# EAGLE design floppy_emul (EAGLE 8.2.2)
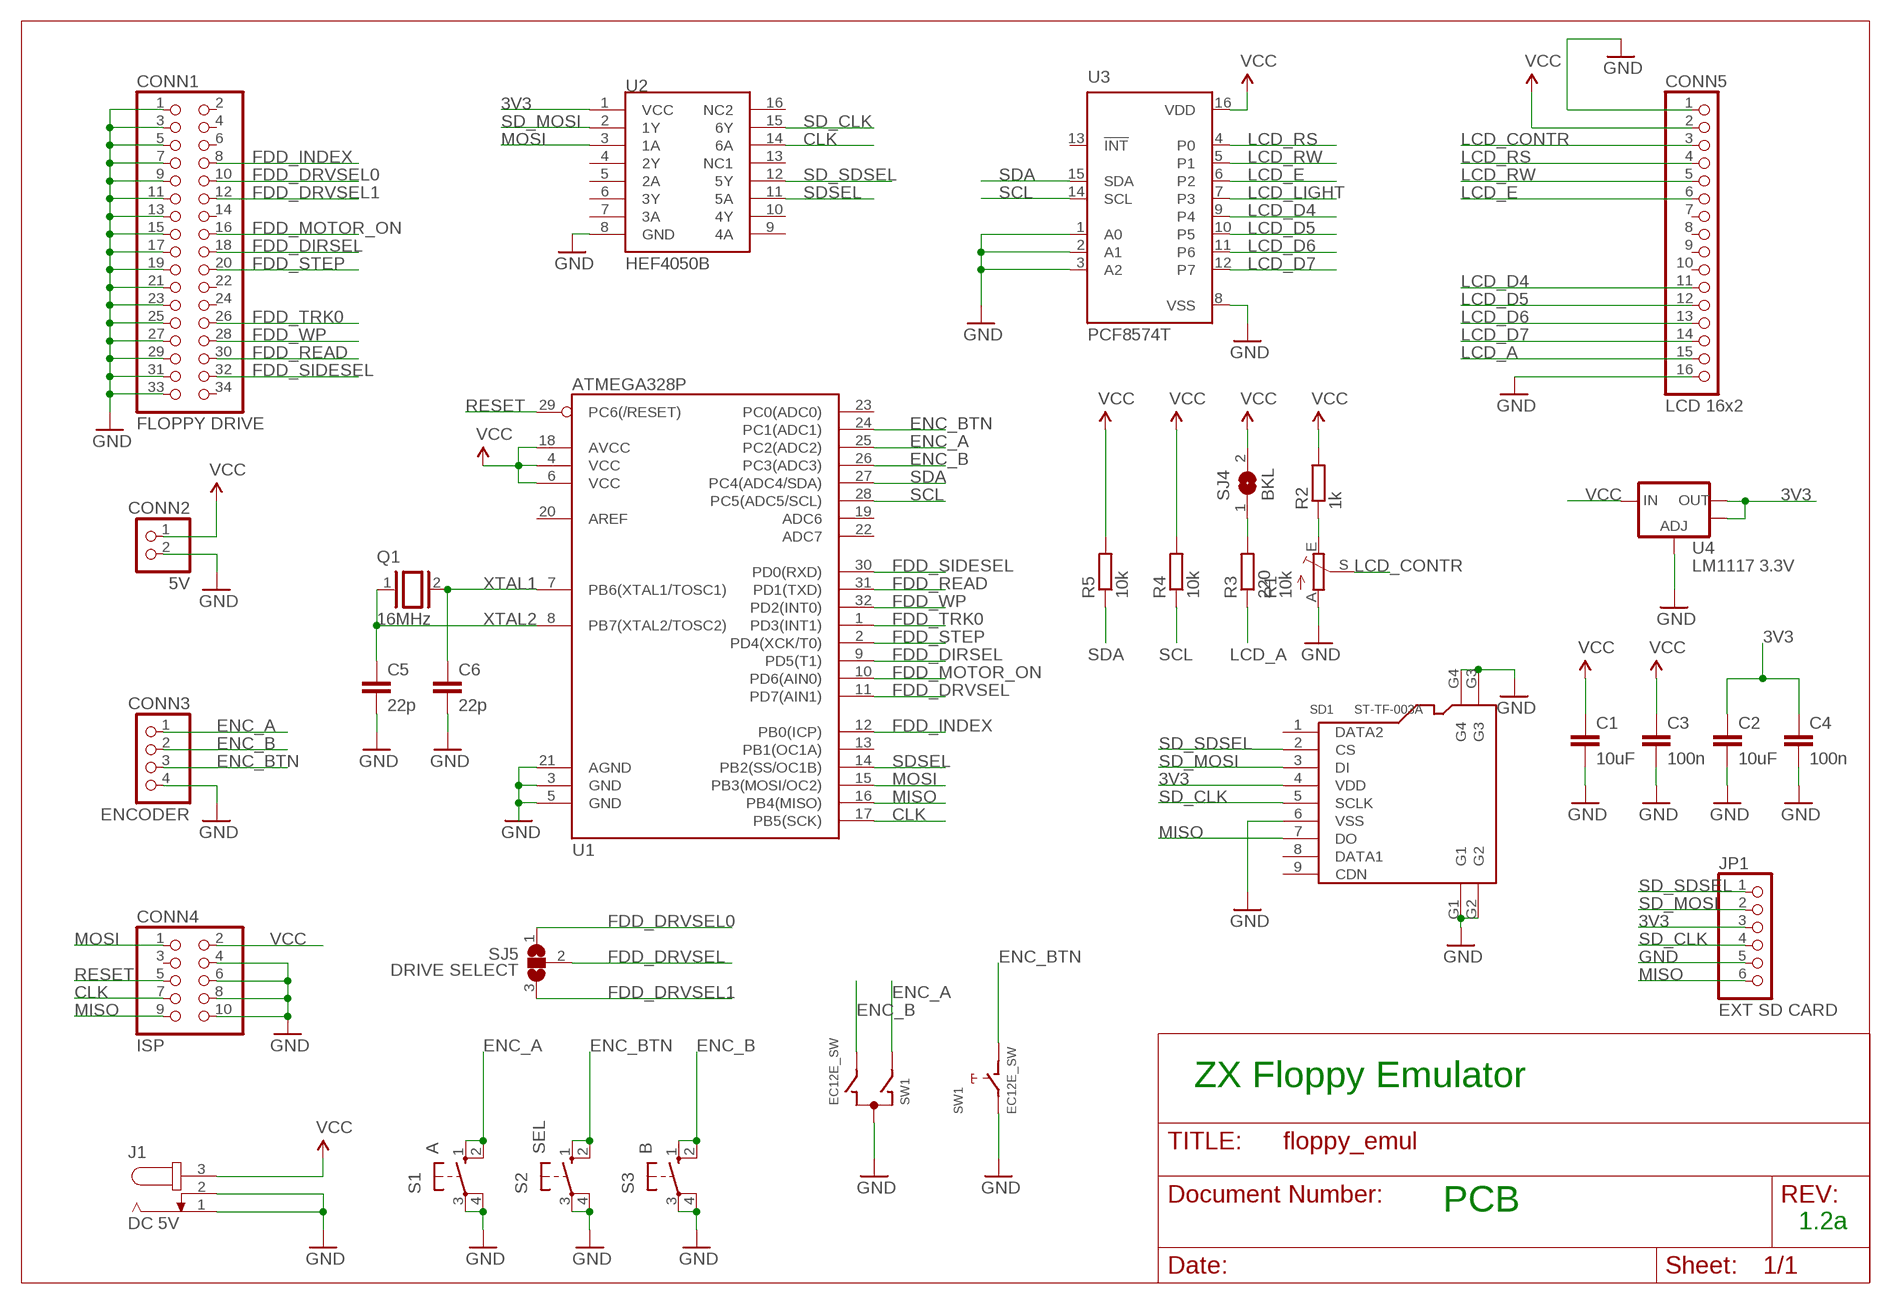
[diagram p0: schematic, sheet 1]

## Parts
C1  10uF  C-EUC0805  [C0805]
C2  10uF  C-EUC0805  [C0805]
C3  100n  C-EUC0805  [C0805]
C4  100n  C-EUC0805  [C0805]
C5  22p  C-EUC0805  [C0805]
C6  22p  C-EUC0805  [C0805]
CONN1  FLOPPY DRIVE  PINHD-2X17  [2X17]
CONN2  5V  PINHD-1X2  [1X02]
CONN3  ENCODER  PINHD-1X4  [1X04]
CONN4  ISP  PINHD-2X5_2.54  [2X05]
CONN5  LCD 16x2  PINHD-1X16  [1X16]
J1  DC 5V  JACK-PLUG0  [SPC4077]
JP1  EXT SD CARD  PINHD-1X6  [1X06]
Q1  16MHz  XTAL/S  [QS]
R1  10k  TRIM_EU-RJ9W  [RJ9W]
R2  1k  R-EU_R0805  [R0805]
R3  220  R-EU_R0805  [R0805]
R4  10k  R-EU_R0805  [R0805]
R5  10k  R-EU_R0805  [R0805]
S1  A  10-XX  [B3F-10XX]
S2  SEL  10-XX  [B3F-10XX]
S3  B  10-XX  [B3F-10XX]
SD1  ST-TF-003A  MICRO-SD-CARD-SOCKET-9P(ST-TF-003A)  [MICRO-SD9+4P-SMD-16.1X14.5X1.85MM]
SJ4  BKL  SJ  [SJ]
SJ5  DRIVE SELECT  SJ2W  [SJ_2]
SW1  EC12E_SW  [ALPS_EC12E_SW]
U1  ATMEGA328P  ATMEGA328_SMT  [TQFP32-08]
U2  HEF4050B  HEF4050BSO16  [SO16]
U3  PCF8574T  [SO16W]
U4  LM1117 3.3V  V_REG_LM1117SOT223  [SOT223]

## Nets
3V3: C2.1 C4.1 JP1.3 SD1.4(VDD) U2.1(VCC) U4.2(OUT) U4.4(OUT)
CLK: CONN4.7 U1.17(PB5(SCK)) U2.14(6A)
ENC_A: CONN3.1 S1.1(S) S1.2(S1) SW1.A U1.25(PC2(ADC2))
ENC_B: CONN3.2 S3.1(S) S3.2(S1) SW1.B U1.26(PC3(ADC3))
ENC_BTN: CONN3.3 S2.1(S) S2.2(S1) SW1.D U1.24(PC1(ADC1))
FDD_DIRSEL: CONN1.18 U1.9(PD5(T1))
FDD_DRVSEL: SJ5.2 U1.11(PD7(AIN1))
FDD_DRVSEL0: CONN1.10 SJ5.1
FDD_DRVSEL1: CONN1.12 SJ5.3
FDD_INDEX: CONN1.8 U1.12(PB0(ICP))
FDD_MOTOR_ON: CONN1.16 U1.10(PD6(AIN0))
FDD_READ: CONN1.30 U1.31(PD1(TXD))
FDD_SIDESEL: CONN1.32 U1.30(PD0(RXD))
FDD_STEP: CONN1.20 U1.2(PD4(XCK/T0))
FDD_TRK0: CONN1.26 U1.1(PD3(INT1))
FDD_WP: CONN1.28 U1.32(PD2(INT0))
GND: C1.2 C2.2 C3.2 C4.2 C5.2 C6.2 CONN1.1 CONN1.3 CONN1.5 CONN1.7 CONN1.9 CONN1.11 CONN1.13 CONN1.15 CONN1.17 CONN1.19 CONN1.21 CONN1.23 CONN1.25 CONN1.27 CONN1.29 CONN1.31 CONN1.33 CONN2.2 CONN3.4 CONN4.4 CONN4.6 CONN4.8 CONN4.10 CONN5.1 CONN5.16 J1.1 J1.2 JP1.5 R1.A S1.3(P) S1.4(P1) S2.3(P) S2.4(P1) S3.3(P) S3.4(P1) SD1.6(VSS) SD1.G1 SD1.G2 SD1.G3 SD1.G4 SW1.C SW1.E U1.3(GND) U1.5(GND) U1.21(AGND) U2.8(GND) U3.1(A0) U3.2(A1) U3.3(A2) U3.8(VSS) U4.1(ADJ)
LCD_A: CONN5.15 R3.1
LCD_CONTR: CONN5.3 R1.S
LCD_D4: CONN5.11 U3.9(P4)
LCD_D5: CONN5.12 U3.10(P5)
LCD_D6: CONN5.13 U3.11(P6)
LCD_D7: CONN5.14 U3.12(P7)
LCD_E: CONN5.6 U3.6(P2)
LCD_LIGHT: U3.7(P3)
LCD_RS: CONN5.4 U3.4(P0)
LCD_RW: CONN5.5 U3.5(P1)
MISO: CONN4.9 JP1.6 SD1.7(DO) U1.16(PB4(MISO))
MOSI: CONN4.1 U1.15(PB3(MOSI/OC2)) U2.3(1A)
N$1: R1.E R2.1
N$2: R3.2 SJ4.1
RESET: CONN4.5 U1.29(PC6(/RESET))
SCL: R4.1 U1.28(PC5(ADC5/SCL)) U3.14(SCL)
SD_CLK: JP1.4 SD1.5(SCLK) U2.15(6Y)
SD_MOSI: JP1.2 SD1.3(DI) U2.2(1Y)
SD_SDSEL: JP1.1 SD1.2(CS) U2.12(5Y)
SDA: R5.1 U1.27(PC4(ADC4/SDA)) U3.15(SDA)
SDSEL: U1.14(PB2(SS/OC1B)) U2.11(5A)
VCC: C1.1 C3.1 CONN2.1 CONN4.2 CONN5.2 J1.3 R2.2 R4.2 R5.2 SJ4.2 U1.4(VCC) U1.6(VCC) U1.18(AVCC) U3.16(VDD) U4.3(IN)
XTAL1: C6.1 Q1.2 U1.7(PB6(XTAL1/TOSC1))
XTAL2: C5.1 Q1.1 U1.8(PB7(XTAL2/TOSC2))
Unconnected: CONN1.2 CONN1.4 CONN1.6 CONN1.14 CONN1.22 CONN1.24 CONN1.34 CONN4.3 CONN5.7 CONN5.8 CONN5.9 CONN5.10 SD1.1(DATA2) SD1.8(DATA1) SD1.9(CDN) SW1.GND1(G) SW1.GND2(G) U1.13(PB1(OC1A)) U1.19(ADC6) U1.20(AREF) U1.22(ADC7) U1.23(PC0(ADC0)) U2.4(2Y) U2.5(2A) U2.6(3Y) U2.7(3A) U2.9(4A) U2.10(4Y) U2.13(NC1) U2.16(NC2) U3.13(!INT)

## Notes on the sheet
- ZX Floppy Emulator
- PCB
- 1.2a

## Library data of the parts
C1-C6 = rcl:C-EU: CAPACITOR, European symbol
CONN1 = pinhead:PINHD-2X17: PIN HEADER
CONN2 = pinhead:PINHD-1X2: PIN HEADER
CONN3 = pinhead:PINHD-1X4: PIN HEADER
CONN4 = pinhead-fixdrills:PINHD-2X5: PIN HEADER
CONN5 = pinhead:PINHD-1X16: PIN HEADER
J1 = con-jack:JACK-PLUG: DC POWER JACK Power Jack, DC, Right Angle, Through Hole, Rated 5A at 16VDC, PC Terminals Distributor: Farnell (www.Farnell.de) Drawing: 84N1161.pdf / 84N1162.pdf Manufacturer: SPC Technology (www.spctechnology.com) Type: SPC4077 / SPC 4078; OC_FARNELL: unknown; OC_NEWARK: unknown
JP1 = pinhead:PINHD-1X6: PIN HEADER
Q1 = special:XTAL/S: CRYSTAL
R1 = pot:TRIM_EU-: POTENTIOMETER
R2-R5 = rcl:R-EU_: RESISTOR, European symbol
S1-S3 = switch-omron:10-XX: OMRON SWITCH; MPN: B3F-1000; OC_FARNELL: 176432; OC_NEWARK: 36M3542
SD1 = Seeed-Connector:MICRO-SD-CARD-SOCKET-9P(ST-TF-003A): 320090000; MPN: ST-TF-003A
SJ4 = jumper:SJ: SMD solder JUMPER
SJ5 = jumper:SJ2W: SMD solder JUMPER
SW1 = switch-alps-mod:EC12E_SW: ALPS rotary Encoder EC12E series with switch; MPN: EC12E2424407; OC_FARNELL: 1520813; OC_NEWARK: 74M1068
U1 = SparkFun-DigitalIC:ATMEGA328_SMT: 32-Pin Atmega328 part Commonly used on Arduino compatible boards Available in QFP and QFN packages TQFP is IC-09069 QFN is non-stock; PROD_ID: IC-09069
U2 = hef4050b:HEF4050B: Addresable Dual Digital Potentiometer
U3 = micro-philips:PCF8574: I2C-Bus Remote 8-bit I/O expander http://www.semiconductors.philips.com/acrobat_download/datasheets/PCF8574_4.pdf; MPN: PCF8574T/3,512; OC_FARNELL: 1201255; OC_NEWARK: 70R6870
U4 = SparkFun-PowerIC:V_REG_LM1117: Voltage Regulator LM1117 Standard adjustable voltage regulator but in SMD form. Spark Fun Electronics SKU : COM-00595

## Board
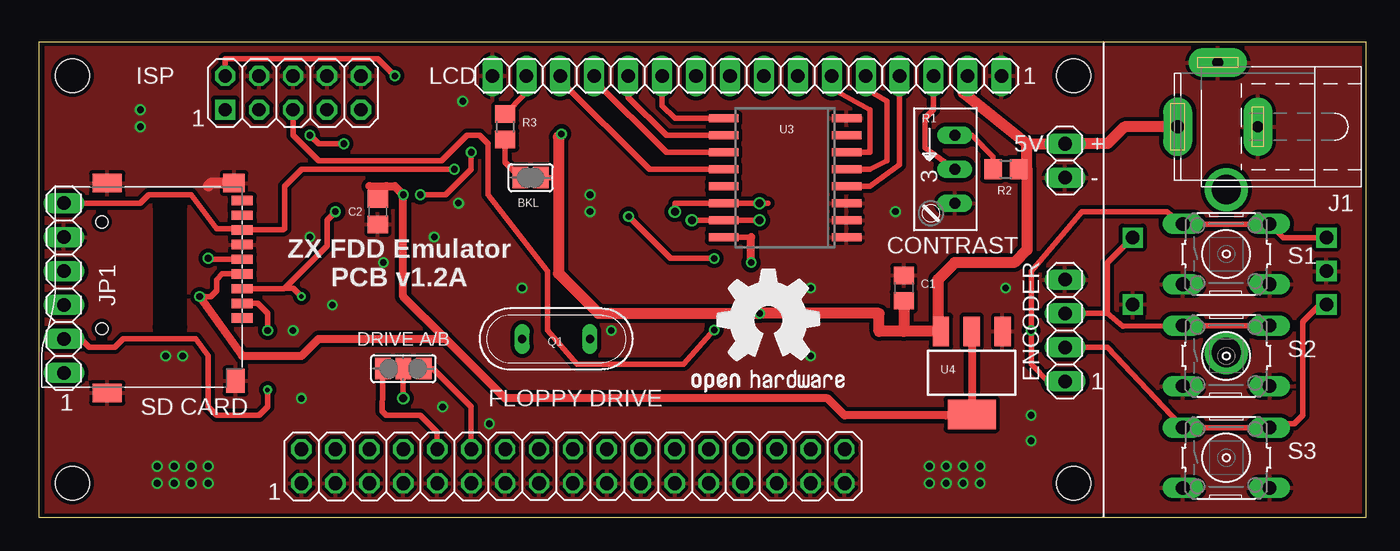
[diagram p1: board, top side]
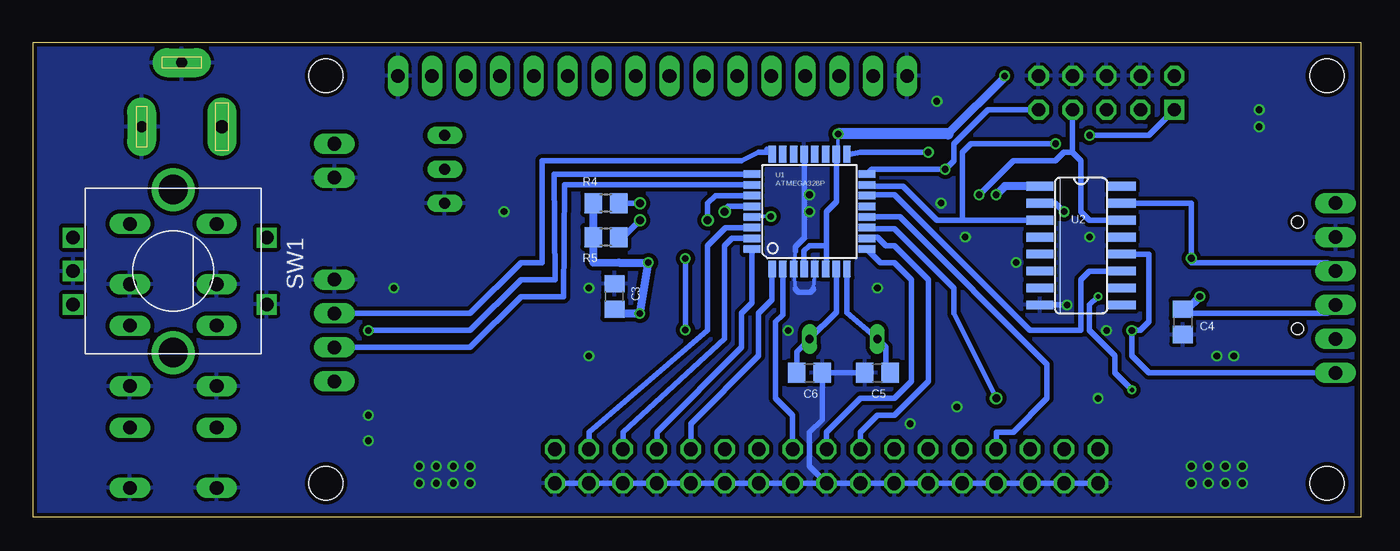
[diagram p2: board, bottom side, seen from below]

Size 99.36 x 35.55 mm. Coordinates in mm from the lower left corner, seen from the top.
Outline: 0,0 99.36,0 99.36,35.55 0,35.55 0,0
Copper layers (1*16): Top 0.035mm / dielectric 1.5mm / Bottom 0.035mm
Design rules "SeeedStudio_2layer_DRU_no_angle_20140221": minimum track width 6mil, minimum drill 12mil, track to track 6mil, track to pad 6mil, pad to pad 6mil, via to via 6mil, smd to smd 0mil, copper to edge 10mil, drill to drill 10mil, minimum pad ring 10mil, minimum via ring 6mil, stop-mask expansion 2mil, vias tented up to drill 100mil, thermal gap 10mil

### Footprints (pad centres in the part's own frame; a part is rotated, then mirrored left to right if it is on the bottom)
C0805 = smd 1.3 x 1.5: 1 -0.95,0; 2 0.95,0
2X17 = drill 1.016 octagon: 1 -20.32,-1.27; 2 -20.32,1.27; 3 -17.78,-1.27; 4 -17.78,1.27; 5 -15.24,-1.27; 6 -15.24,1.27; 7 -12.7,-1.27; 8 -12.7,1.27; 9 -10.16,-1.27; 10 -10.16,1.27; 11 -7.62,-1.27; 12 -7.62,1.27; 13 -5.08,-1.27; 14 -5.08,1.27; 15 -2.54,-1.27; 16 -2.54,1.27; 17 0,-1.27; 18 0,1.27; 19 2.54,-1.27; 20 2.54,1.27; 21 5.08,-1.27; 22 5.08,1.27; 23 7.62,-1.27; 24 7.62,1.27; 25 10.16,-1.27; 26 10.16,1.27; 27 12.7,-1.27; 28 12.7,1.27; 29 15.24,-1.27; 30 15.24,1.27; 31 17.78,-1.27; 32 17.78,1.27; 33 20.32,-1.27; 34 20.32,1.27
1X02 = drill 1.016 long: 1 -1.27,0; 2 1.27,0
1X04 = drill 1.016 long: 1 -3.81,0; 2 -1.27,0; 3 1.27,0; 4 3.81,0
2X05 = drill 1 square: 1 -5.08,-1.27 | drill 1 octagon: 2 -5.08,1.27; 3 -2.54,-1.27; 4 -2.54,1.27; 5 0,-1.27; 6 0,1.27; 7 2.54,-1.27; 8 2.54,1.27; 9 5.08,-1.27; 10 5.08,1.27
1X16 = drill 1.016 long: 1 -19.05,0; 2 -16.51,0; 3 -13.97,0; 4 -11.43,0; 5 -8.89,0; 6 -6.35,0; 7 -3.81,0; 8 -1.27,0; 9 1.27,0; 10 3.81,0; 11 6.35,0; 12 8.89,0; 13 11.43,0; 14 13.97,0; 15 16.51,0; 16 19.05,0
SPC4077 = drill 0.8 pad 2.184 long: 1 -3,0; 2 0,-4.8 | drill 1 pad 2.184 long: 3 3,0
1X06 = drill 1.016 long: 1 -6.35,0; 2 -3.81,0; 3 -1.27,0; 4 1.27,0; 5 3.81,0; 6 6.35,0
QS = drill 0.61 long: 1 -2.54,0; 2 2.54,0
RJ9W = drill 0.813 long: A 2.54,0.635; E -2.54,0.635; S 0,0.635
R0805 = smd 1.3 x 1.5: 1 -0.95,0; 2 0.95,0
B3F-10XX = drill 1.016 long: 1 -3.251,2.261; 2 3.251,2.261; 3 -3.251,-2.261; 4 3.251,-2.261
MICRO-SD9+4P-SMD-16.1X14.5X1.85MM = smd 1.6 x 0.7: 1 0,2.25; 2 0,1.15; 3 0,0.05; 4 0,-1.05; 5 0,-2.15; 6 0,-3.25; 7 0,-4.35; 8 0,-5.45; 9 0,-6.55 | smd 1.6 x 1.4: G1 0.6,-7.85 | smd 2.2 x 1.4: G2 10.1,-7.85; G3 10.1,7.85 | smd 1.4 x 1.8: G4 0.5,6.95 | hole 0.9: 10.5,-4.95; 10.5,3.05
SJ = smd 1.168 x 1.6: 1 -0.762,0; 2 0.762,0
SJ_2 = smd 1.168 x 1.6: 1 -1.524,0; 2 0,0; 3 1.524,0
ALPS_EC12E_SW = drill 1 square: A -2.5,-7.5; B 2.5,-7.5; C 0,-7.5; D -2.5,7; E 2.5,7 | drill 2.2: GND1 -6.1,0; GND2 6.1,0
TQFP32-08 = smd 1.27 x 0.559: 1 -4.293,2.8; 2 -4.293,2; 3 -4.293,1.2; 4 -4.293,0.4; 5 -4.293,-0.4; 6 -4.293,-1.2; 7 -4.293,-2; 8 -4.293,-2.8; 17 4.293,-2.8; 18 4.293,-2; 19 4.293,-1.2; 20 4.293,-0.4; 21 4.293,0.4; 22 4.293,1.2; 23 4.293,2; 24 4.293,2.8 | smd 0.559 x 1.27: 9 -2.8,-4.293; 10 -2,-4.293; 11 -1.2,-4.293; 12 -0.4,-4.293; 13 0.4,-4.293; 14 1.2,-4.293; 15 2,-4.293; 16 2.8,-4.293; 25 2.8,4.293; 26 2,4.293; 27 1.2,4.293; 28 0.4,4.293; 29 -0.4,4.293; 30 -1.2,4.293; 31 -2,4.293; 32 -2.8,4.293
SO16 = smd 0.66 x 2.032: 1 -4.445,-3.073; 2 -3.175,-3.073; 3 -1.905,-3.073; 4 -0.635,-3.073; 5 0.635,-3.073; 6 1.905,-3.073; 7 3.175,-3.073; 8 4.445,-3.073; 9 4.445,3.073; 10 3.175,3.073; 11 1.905,3.073; 12 0.635,3.073; 13 -0.635,3.073; 14 -1.905,3.073; 15 -3.175,3.073; 16 -4.445,3.073
SO16W = smd 0.6 x 2.2: 1 -4.445,-4.6; 2 -3.175,-4.6; 3 -1.905,-4.6; 4 -0.635,-4.6; 5 0.635,-4.6; 6 1.905,-4.6; 7 3.175,-4.6; 8 4.445,-4.6; 9 4.445,4.6; 10 3.175,4.6; 11 1.905,4.6; 12 0.635,4.6; 13 -0.635,4.6; 14 -1.905,4.6; 15 -3.175,4.6; 16 -4.445,4.6
SOT223 = smd 1.219 x 2.235: 1 -2.311,-3.099; 2 0,-3.099; 3 2.311,-3.099 | smd 3.6 x 2.2: 4 0,3.099
DRILL_0.1000 = hole 2.54: 0,0

### Placement (x,y rotation side)
C1  64.77,17.14 90 top
C2  25.4,22.86 270 top
C3  55.88,16.51 90 bottom
C4  13.34,14.61 270 bottom
C5  36.2,10.79 180 bottom
C6  41.27,10.79 0 bottom
CONN1  40.01,3.81 0 top
CONN2  76.83,26.67 270 top
CONN3  76.83,13.97 90 top
CONN4  19.05,31.75 0 top
CONN5  53.02,33.02 180 top
J1  88.27,29.21 180 top
JP1  1.91,17.14 90 top
Q1  38.73,13.34 0 top
R1  67.94,26.04 270 top
R2  72.39,26.04 0 top
R3  34.92,29.21 270 top
R4  56.52,23.5 180 bottom
R5  56.52,20.95 180 bottom
S1  88.9,19.68 0 top
S2  88.9,12.06 0 top
S3  88.9,4.45 0 top
SD1  15.24,17.14 180 top
SJ4  36.83,25.4 0 top
SJ5  27.3,11.11 0 top
SW1  88.9,18.41 270 bottom
U1  41.27,22.86 90 bottom
U2  20.95,20.32 270 bottom
U3  55.88,25.4 90 top
U4  69.85,10.79 180 top
U$1  [DRILL_0.1000]  2.54,2.54 0 top
U$2  [DRILL_0.1000]  2.54,33.02 0 top
U$3  [DRILL_0.1000]  77.47,33.02 0 top
U$4  [DRILL_0.1000]  77.47,2.54 0 top
U$5  [OSHW1]  48.26,7.62 0 top

### Tracks (layer width: path | path; a pad name or v marks a point on that pad's centre or on a via)
3V3  (via drill 0.5)
  Top 0.406: v12.06,16.51 12.9,16.51 13.34,16.95 13.34,17.78 13.75,18.2 SD1.4
  Top 0.61: U4.2 U4.4 67.94,7.62 60.33,7.62 59.05,8.89 34.92,8.89 30.48,13.34 | 30.48,13.34 27.3,16.51 v27.3,24.13 26.67,24.77 26.04,24.77 | 24.77,24.77 26.04,24.77 | v12.06,16.51 15.24,12.06 19.68,12.06 20.95,13.34 30.48,13.34 | C2.1 25.4,24.13 26.04,24.77
  Bottom 0.406: 13.34,15.88 13.33,15.87 13.34,15.87 C4.1 13.34,15.24 2.54,15.24 JP1.3
  Bottom 0.61: v27.3,24.13 26.67,24.77 U2.1 | C4.1 13.02,15.55 v12.06,16.51
CLK  (via drill 0.5)
  Top 0.406: v28.57,24.13 30.48,24.13 32.38,26.04 v32.38,27.3
  Bottom 0.406: U2.14 20.32,22.23 20.95,22.86 20.95,26.67 21.59,27.3 | v32.38,27.3 37.47,27.3 38.25,27.15 U1.17 | CONN4.7 21.59,27.3 | 21.59,27.3 22.23,27.3 22.86,26.67 26.04,26.67 v28.57,24.13
ENC_A  (via drill 0.5)
  Top 0.406: S1.2 92.08,21.91 85.72,21.91 S1.1 84.45,22.86 78.11,22.86 74.3,18.41 v74.3,13.97 74.3,11.43 75.56,10.16 CONN3.1 | 92.71,21.59 S1.2 | S1.2 93.18,20.91 SW1.A
  Bottom 0.406: U1.25 60.38,25.66 60.33,17.78 62.87,17.78 66.67,13.97 v74.3,13.97
ENC_B
  Top 0.406: CONN3.2 80.01,12.7 85.37,6.99 S3.1 S3.2 92.43,6.99 93.98,6.99 94.61,7.62 94.61,14.61 95.92,15.91 SW1.B
  Bottom 0.406: U1.26 59.59,24.86 59.69,16.51 62.87,16.51 66.67,12.7 CONN3.2
ENC_BTN
  Top 0.406: CONN3.3 80.01,15.24 | 80.01,15.24 81.17,14.29 S2.1 S2.2 | 80.01,15.24 80.01,19.05 81.88,20.91 SW1.D
  Bottom 0.406: CONN3.3 66.67,15.24 62.87,19.05 61.28,19.05 61.28,26.67 46.35,26.67 45.09,27.3 44.45,27.3 44.45,27.53 U1.24
FDD_DIRSEL
  Bottom 0.406: CONN1.18 40.01,6.35 37.47,8.89 34.92,8.89 33.66,10.16 33.66,17.78 34.92,19.05 35.97,19.05 U1.9
FDD_DRVSEL  (via drill 0.6)
  Top 0.406: SJ5.2 v27.3,8.89
  Bottom 0.406: v27.3,8.89 30.48,15.24 30.48,17.14 34.92,21.59 36.91,21.59 U1.11
FDD_DRVSEL0
  Top 0.406: CONN1.10 29.84,6.35 28.57,7.62 26.04,7.62 25.72,7.94 SJ5.1
FDD_DRVSEL1
  Top 0.406: CONN1.12 32.38,8.26 29.53,11.11 SJ5.3
FDD_INDEX
  Bottom 0.406: U1.12 34.52,22.46 23.5,11.43 23.5,8.89 26.04,6.35 27.3,6.35 CONN1.8
FDD_MOTOR_ON
  Bottom 0.406: CONN1.16 37.47,6.35 36.2,7.62 34.92,7.62 32.38,10.16 32.38,17.78 34.92,20.32 35.56,20.32 36.2,20.95 36.89,20.95 U1.10
FDD_READ
  Bottom 0.406: U1.31 47.09,20.86 47.62,20.32 47.62,13.34 55.24,6.35 CONN1.30
FDD_SIDESEL
  Bottom 0.406: U1.30 47.55,21.66 48.9,20.32 48.9,13.97 57.78,6.35 CONN1.32
FDD_STEP
  Bottom 0.406: U1.2 43.27,15.14 43.81,14.61 43.81,8.89 42.55,7.62 CONN1.20
FDD_TRK0
  Bottom 0.406: U1.1 44.08,16.25 45.09,15.24 45.09,12.06 50.16,6.99 CONN1.26
FDD_WP
  Bottom 0.406: U1.32 45.57,16.03 46.35,15.24 46.35,12.7 52.7,6.35 CONN1.28
GND  (via drill 0.5)
  Top 0.813: SD1.G1 12.93,25 12.7,24.77
  Bottom 0.254: 40.97,17.12 U1.5 | 42.34,17.12 U1.3 42.34,19.89 | 41.66,27.08 U1.21 | 19.48,2.62 CONN1.1
  Bottom 0.406: C5.2 C6.2 40.33,7.3 41.27,6.35 41.27,3.81 CONN1.17 | CONN1.1 CONN1.3 CONN1.5 CONN1.7 CONN1.9 CONN1.11 CONN1.13 CONN1.15 CONN1.17 | CONN1.17 CONN1.19 CONN1.21 CONN1.23 CONN1.25 CONN1.27 CONN1.29 CONN1.31 CONN1.33 | 40.97,17.12 40.97,17.07 41.2,16.84 42.11,16.84 42.34,17.07 42.34,17.12 | 41.66,27.08 41.66,20.9 42.34,20.22 42.34,19.89 | v22,15.88 U2.8
  other vias: 64.14,22.86 66.67,2.54 67.94,2.54 69.22,2.54 66.67,3.81 67.94,3.81 69.22,3.81 8.89,2.54 10.16,2.54 11.43,2.54 11.43,3.81 10.16,3.81 8.89,3.81 36.2,17.14 41.27,24.13 31.43,23.5 72.39,17.14 74.3,7.62 74.3,5.71 31.75,31.11 7.62,30.48 7.62,29.21 12.7,3.81 12.7,2.54 19.68,8.89 19.05,13.97 41.27,22.86 57.78,17.14 57.78,12.06 70.48,3.81 70.48,2.54 42.86,13.97 20.32,20.95 25.81,19.05 29.62,20.95 30.25,8.26 33.74,6.99 10.79,12.06 9.53,12.06
  pour Top (isolate 0.305): 0.64,35.56 99.69,35.56 99.69,0 0.64,0
  pour Bottom (isolate 0.305): 0.64,35.56 99.69,35.56 99.69,0 0.64,0
LCD_A
  Top 0.254: 35.03,30.28 R3.1 | 36.73,32.94 36.75,32.92 CONN5.15
  Top 0.406: 35.03,30.28 36.3,31.56 36.73,32.94 36.4,33.25
LCD_CONTR
  Top 0.406: CONN5.3 66.99,30.48 66.36,29.84 66.36,27.62 R1.S
LCD_D4
  Top 0.406: CONN5.11 46.67,30.8 47.62,29.84 U3.9
LCD_D5
  Top 0.406: CONN5.12 44.13,31.43 46.99,28.57 U3.10
LCD_D6
  Top 0.406: CONN5.13 41.59,32.7 46.99,27.3 U3.11
LCD_D7
  Top 0.406: CONN5.14 39.05,32.7 45.72,26.04 U3.12
LCD_E
  Top 0.406: CONN5.6 59.37,32.07 62.23,30.48 62.23,27.3 U3.6
LCD_RS
  Top 0.406: CONN5.4 64.45,26.35 62.23,24.77 U3.4
LCD_RW
  Top 0.406: CONN5.5 61.91,32.07 63.5,31.11 63.5,26.67 62.23,26.04 U3.5
MISO  (via drill 0.5)
  Top 0.406: v31.11,26.04 19.68,26.04 18.41,24.77 18.41,21.59 18.32,21.5 SD1.7 15.14,21.59 13.34,21.59 11.43,24.13 8.26,24.13 7.62,23.5 JP1.6
  Bottom 0.406: U1.16 36.61,26.04 v31.11,26.04 30.48,26.67 30.48,27.94 27.94,30.48 CONN4.9
MOSI  (via drill 0.5)
  Top 0.406: v22.86,27.94 20.95,27.94 v20.32,28.57
  Bottom 0.406: U2.3 29.84,22.23 | 29.84,22.23 31.75,22.23 34.29,24.77 36.89,24.77 U1.15 | 29.84,22.23 29.84,27.3 29.21,27.94 v22.86,27.94 | v20.32,28.57 15.88,28.57 CONN4.1
N$1
  Top 0.406: R1.E 69.85,28.57 71.44,26.98 R2.1
N$2
  Top 0.406: R3.2 34.92,26.54 SJ4.1
RESET  (via drill 0.5)
  Top 0.406: CONN4.5 19.05,28.57 20.95,26.67 30.16,26.67 32.07,28.57 33.02,28.57 33.66,27.94 33.66,24.13 38.1,18.41 38.1,13.97 40.32,11.43 48.26,11.43 v50.57,14.01 | v50.57,19.36 47.32,19.36 v44.17,22.5
  Bottom 0.254: v44.17,22.5 45.54,22.5 U1.29
  Bottom 0.406: v50.57,14.01 v50.57,19.36
SCL  (via drill 0.6)
  Top 0.406: v47.62,22.86 47.62,23.5 U3.14 v53.98,23.5 54.61,23.5
  Bottom 0.406: U1.28 47.39,23.26 v47.62,22.86 | R4.1 v53.98,23.5
SD_CLK  (via drill 0.5)
  Top 0.406: SD1.5 12.77,19.3 v12.7,19.37
  Bottom 0.406: U2.15 12.7,23.5 v12.7,19.37 12.7,19.05 2.54,19.05 JP1.4
SD_MOSI  (via drill 0.35, 0.5)
  Top 0.406: v22.23,22.86 21.59,22.23 21.59,20.32 18.41,17.14 | SD1.3 18.36,17.09 18.41,17.14 | JP1.2 3.17,13.34 3.81,12.7 5.71,12.7 6.35,13.34 11.75,13.34 12.7,12.06 12.7,8.26 13.34,7.62 16.51,7.62 17.14,8.26 v17.14,9.53 | v19.68,16.51 19.05,17.14 18.41,17.14
  Bottom 0.406: U2.2 22.86,23.5 v22.23,22.86 | v17.14,9.53 18.41,10.79 18.41,12.06 20.32,13.97 20.32,15.88 v19.68,16.51
SD_SDSEL  (via drill 0.5)
  Top 0.406: SD1.2 16.39,15.99 17.14,15.24 v17.14,13.97
  Bottom 0.406: U2.12 15.88,19.68 15.88,14.61 16.51,13.97 v17.14,13.97 17.14,12.06 15.88,10.79 JP1.1
SDA  (via drill 0.6)
  Top 0.406: v48.9,22.23 U3.15 v53.98,22.23
  Bottom 0.406: U1.27 48.33,24.06 48.9,23.5 v48.9,22.23 | v53.98,22.23 55.24,20.95 R5.1
SDSEL
  Bottom 0.406: U2.11 20.32,18.41 20.95,17.78 20.95,13.97 24.77,13.97 34.92,24.13 36.91,24.13 U1.14
VCC  (via drill 0.5)
  Top 0.254: 55.14,15.42 v53.98,15.24 | 38.91,28.45 v39.14,28.68
  Top 0.406: CONN4.2 13.97,34.29 25.4,34.29 v26.67,33.02 | U3.16 53.34,20.95 | SJ4.2 38.91,25.4 | R2.2 73.96,26.04 73.98,26.02
  Top 0.61: v53.34,19.05 53.34,20.95
  Top 0.813: 73.98,27.94 69.22,31.75 CONN5.2 | 73.98,27.94 CONN2.1 80.01,27.94 81.28,29.21 J1.3 | 64.77,13.89 U4.3 67.31,14.12 67.31,17.78 68.58,19.05 73.03,19.05 73.98,20 73.98,26.02 73.98,27.94 | 64.77,13.89 62.92,13.89 62.92,15.24 v53.98,15.24 41.91,15.24 38.91,18.24 38.91,25.4 38.91,28.45 | C1.1 64.77,13.89
  Bottom 0.254: v39.14,28.68 39.14,27.3 U1.18
  Bottom 0.406: U1.18 39.27,23.59 40.01,22.86 40.01,20.32 | 40.01,20.32 40.01,18.64 U1.6 | U1.4 41.67,19.92 41.27,20.32 40.01,20.32 | v26.67,33.02 26.62,32.97 | R5.2 R4.2
  Bottom 0.61: 26.62,32.97 30.91,28.68 | R4.2 57.47,19.06 55.55,19.05 v53.34,19.05 v53.98,15.24 55.88,15.24 C3.1
  Bottom 0.813: 30.91,28.68 v39.14,28.68
XTAL1
  Bottom 0.406: U1.7 39.27,15.34 Q1.2 42.23,12.38 C6.1
XTAL2
  Bottom 0.406: U1.8 38.48,15.3 Q1.1 35.56,12.7 35.56,11.12 | 35.56,10.79 35.56,11.12 | 35.56,11.12 C5.1

### Text on the board
tPlace: LCD | 1 | 1 | 5V | + | - | BKL | CONTRAST | ZX FDD Emulator / PCB v1.2A | DRIVE A/B | ENCODER | 1 | 1 | SD CARD | 1